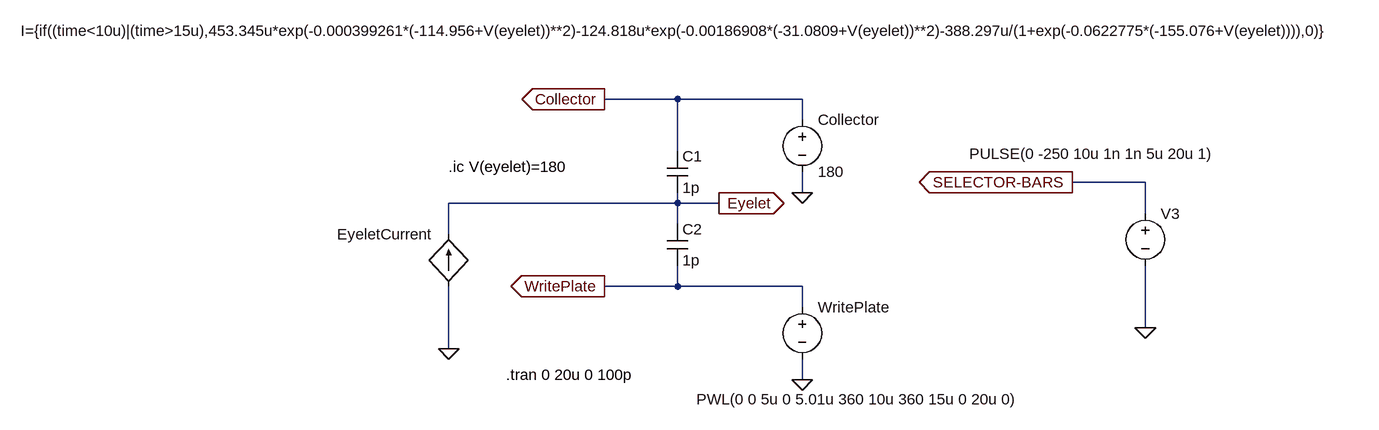
[diagram p0: schematic eyeletSimWriting0.asc]
eyeletSimWriting0.asc, the LTspice schematic file:
Version 4
SHEET 1 1956 680
WIRE 144 0 32 0
WIRE 336 0 144 0
WIRE 336 32 336 0
WIRE 144 80 144 0
WIRE 864 128 752 128
WIRE 336 144 336 112
WIRE 144 160 144 144
WIRE 144 160 -208 160
WIRE 208 160 144 160
WIRE 864 176 864 128
WIRE 144 192 144 160
WIRE -208 208 -208 160
WIRE 144 288 144 256
WIRE 144 288 32 288
WIRE 336 288 144 288
WIRE 336 320 336 288
WIRE 864 352 864 256
WIRE -208 384 -208 288
WIRE 336 432 336 400
FLAG 336 144 0
FLAG 336 432 0
FLAG 208 160 Eyelet
IOPIN 208 160 Out
FLAG 32 0 Collector
IOPIN 32 0 Out
FLAG 32 288 WritePlate
IOPIN 32 288 Out
FLAG -208 384 0
FLAG 864 352 0
FLAG 752 128 SELECTOR-BARS
IOPIN 752 128 Out
SYMBOL cap 128 80 R0
SYMATTR InstName C1
SYMATTR Value 1p
SYMBOL cap 128 192 R0
SYMATTR InstName C2
SYMATTR Value 1p
SYMBOL voltage 336 16 R0
WINDOW 123 0 0 Left 0
WINDOW 39 0 0 Left 0
SYMATTR InstName Collector
SYMATTR Value 180
SYMBOL voltage 336 304 R0
WINDOW 123 0 0 Left 0
WINDOW 39 0 0 Left 0
WINDOW 3 -163 158 Left 2
SYMATTR Value PWL(0 0 5u 0 5.01u 360 10u 360 15u 0 20u 0)
SYMATTR InstName WritePlate
SYMBOL bi -208 288 R180
WINDOW 0 24 80 Left 2
WINDOW 3 -1400 393 Left 2
SYMATTR InstName EyeletCurrent
SYMATTR Value I={if((time<10u)|(time>15u),453.345u*exp(-0.000399261*(-114.956+V(eyelet))**2)-124.818u*exp(-0.00186908*(-31.0809+V(eyelet))**2)-388.297u/(1+exp(-0.0622775*(-155.076+V(eyelet)))),0)}
SYMBOL voltage 864 160 R0
WINDOW 123 0 0 Left 0
WINDOW 39 0 0 Left 0
WINDOW 3 -271 -76 Left 2
SYMATTR Value PULSE(0 -250 10u 1n 1n 5u 20u 1)
SYMATTR InstName V3
TEXT -120 424 Left 2 !.tran 0 20u 0 100p
TEXT -208 104 Left 2 !.ic V(eyelet)=180

The netlist it stands for:
* eyeletSimWriting0.asc
C1 Collector Eyelet 1p
C2 Eyelet WritePlate 1p
V§Collector Collector 0 180
V§WritePlate WritePlate 0 PWL(0 0 5u 0 5.01u 360 10u 360 15u 0 20u 0)
B§EyeletCurrent 0 Eyelet I={if((time<10u)|(time>15u),453.345u*exp(-0.000399261*(-114.956+V(eyelet))**2)-124.818u*exp(-0.00186908*(-31.0809+V(eyelet))**2)-388.297u/(1+exp(-0.0622775*(-155.076+V(eyelet)))),0)}
V3 SELECTOR-BARS 0 PULSE(0 -250 10u 1n 1n 5u 20u 1)
.tran 0 20u 0 100p
.ic V(eyelet)=180
.backanno
.end